# EAGLE board iMX233-OLinuXino-NANO_Rev_B (EAGLE 6.6.0), part 1 of 2
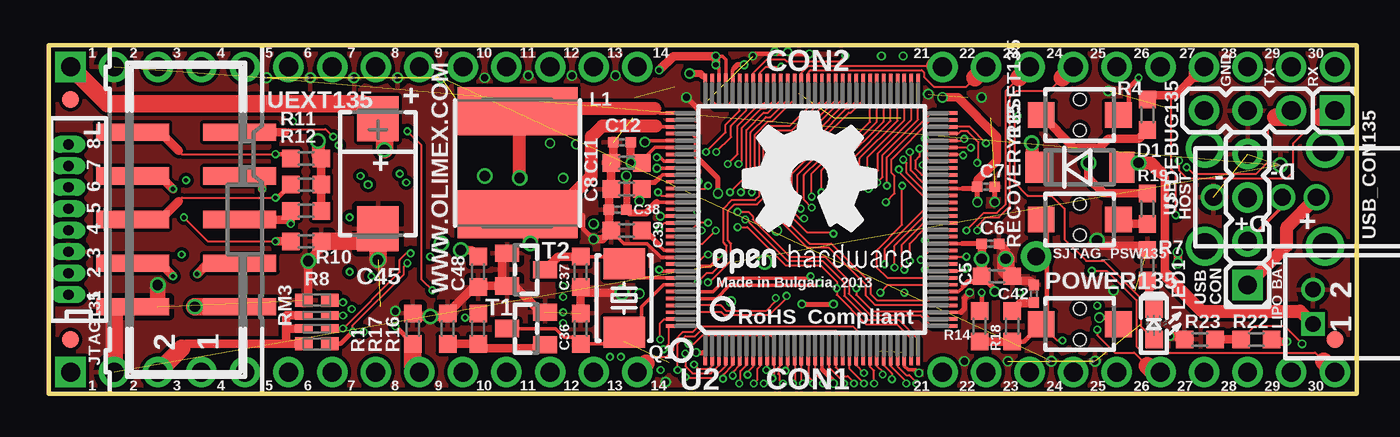
[diagram p1: board, top side]
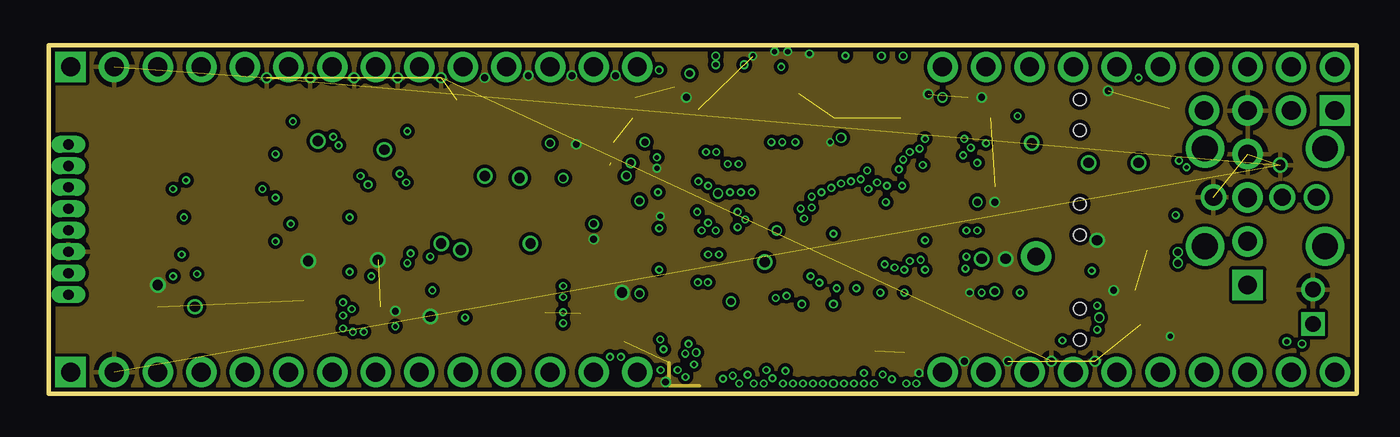
[diagram p2: board, inner layer Route2]
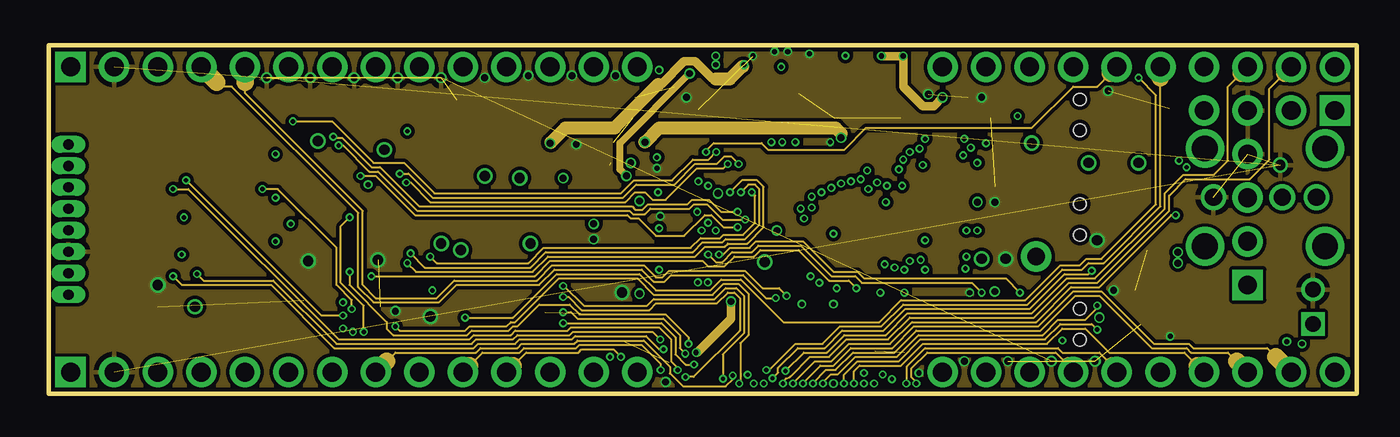
[diagram p3: board, inner layer Route3]
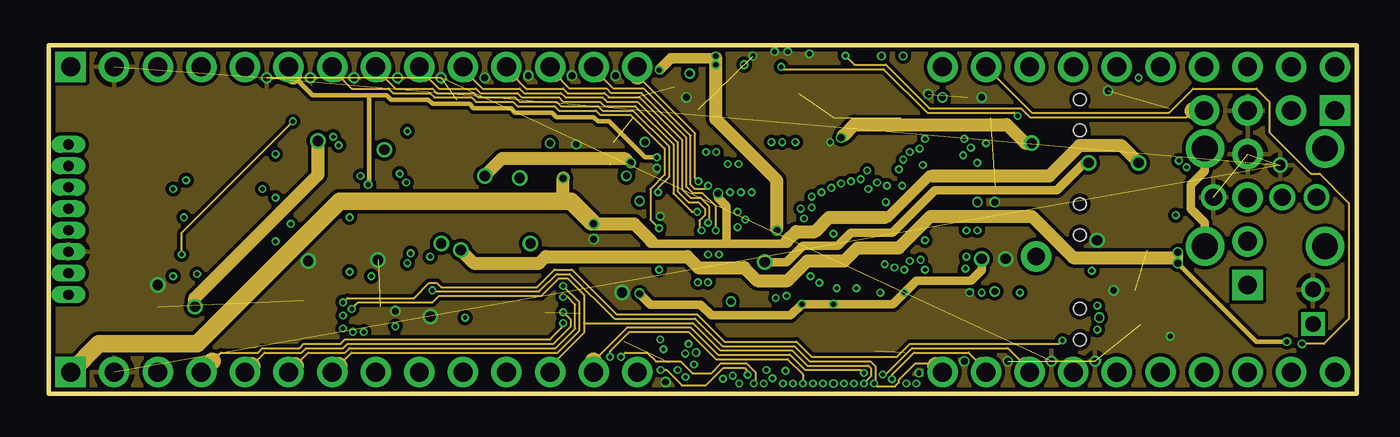
[diagram p4: board, inner layer Route14]
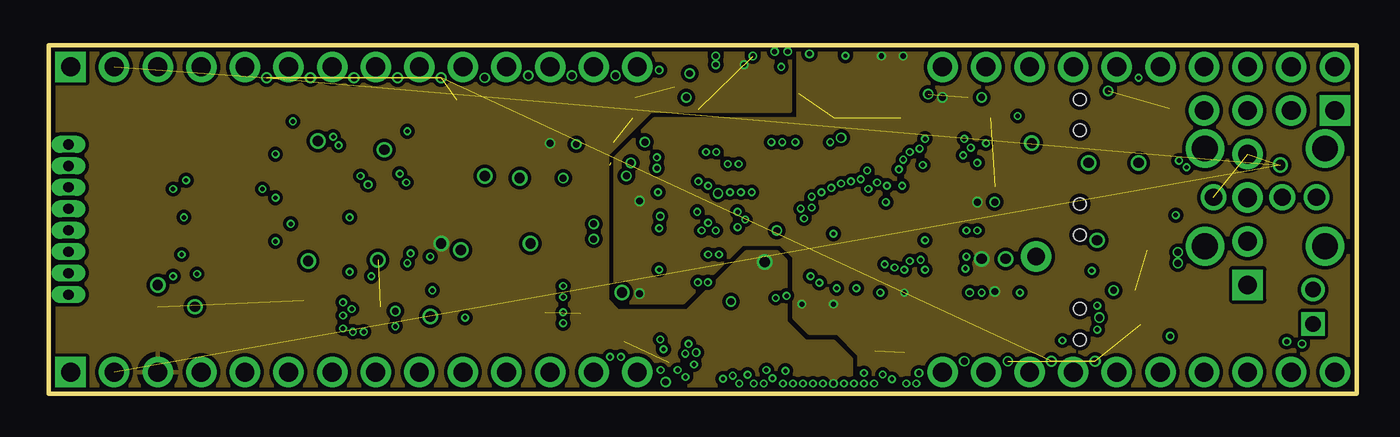
[diagram p5: board, inner layer Route15]
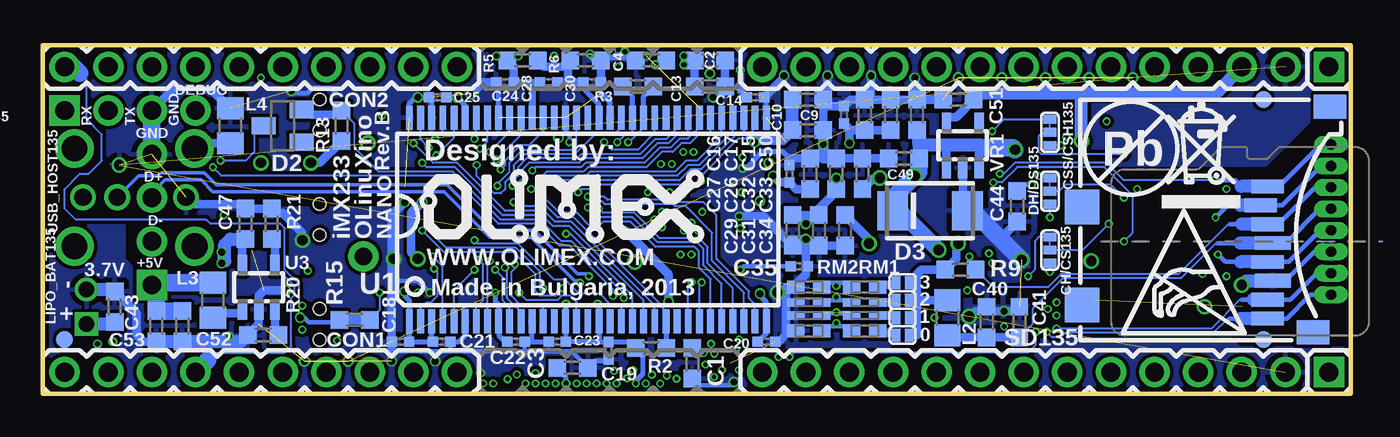
[diagram p6: board, bottom side, seen from below]

Size 76.2 x 20.32 mm. Coordinates in mm from the lower left corner, seen from the top.
Outline: 0,0 76.2,0 76.2,20.32 0,20.32 0,0
Copper layers (1*2+3*14+15*16): Top 0.035mm / dielectric 0.13mm / Route2 0.035mm / dielectric 0.6mm / Route3 0.035mm / dielectric 0.13mm / Route14 0.035mm / dielectric 0.6mm / Route15 0.035mm / dielectric 0.13mm / Bottom 0.035mm
Design rules "default": minimum track width 5mil, minimum drill 10mil, track to track 5mil, track to pad 5mil, pad to pad 5mil, via to via 5mil, smd to smd 1mil, copper to edge 10mil, drill to drill 8mil, minimum pad ring 5mil, minimum via ring 4mil, stop-mask expansion 4mil, vias tented up to drill 25mil, thermal gap 12mil
tRestrict: 2 lines
bRestrict: 49 lines

## Footprints (pad centres in the part's own frame; a part is rotated, then mirrored left to right if it is on the bottom)
SJ_1_SMALLER = smd 0.508 x 0.762: 1 -0.381,0; 2 0.381,0
C0603_DWS = smd 1.016 x 1.016: 1 -0.889,0; 2 0.889,0
C0402_TI = smd 0.61 x 0.584: 1 -0.508,0; 2 0.508,0
CT7343 = smd 2.6 x 2.4: + -3.2,0; - 3.2,0
SJ_2_SMALLER = smd 0.508 x 0.762: 1 -0.762,0; 2 0,0; 3 0.762,0
HN1X30_WITHOUT(15-20) = drill 1.1 pad 1.778 square: 1 -36.83,0 | drill 1.1 pad 1.778: 2 -34.29,0; 3 -31.75,0; 4 -29.21,0; 5 -26.67,0; 6 -24.13,0; 7 -21.59,0; 8 -19.05,0; 9 -16.51,0; 10 -13.97,0; 11 -11.43,0; 12 -8.89,0; 13 -6.35,0; 14 -3.81,0; 21 13.97,0; 22 16.51,0; 23 19.05,0; 24 21.59,0; 25 24.13,0; 26 26.67,0; 27 29.21,0; 28 31.75,0; 29 34.29,0; 30 36.83,0
MLL-41 = smd 1.45 x 1.8: A 2.445,0; K -2.445,0
SOT23C = smd 1 x 1.4: 1 -0.95,-1.1; 2 0.95,-1.1; 3 0,1.1
DO214AA = smd 1.778 x 2.286: A 2.177,0; C -2.177,0
WU08S = drill 0.6 pad 0.991 long: 1 -4.375,0; 2 -3.125,0; 3 -1.875,0; 4 -0.625,0; 5 0.625,0; 6 1.875,0; 7 3.125,0; 8 4.375,0
L7078 = smd 2.8 x 7: 1 -3,0; 2 3,0
L0805_5MIL_DWS = smd 1.27 x 1.524: 1 -1.016,0; 2 1.016,0
LED-0603 = smd 1.016 x 1.016: A 0.889,0; C -0.889,0
DW02R = drill 0.9 square: 1 -1,0 | drill 0.9: 2 1,0
IT1185AU2 = smd 1.55 x 1.5: 1 -2.25,0; 2 2.25,0 | hole 0.7: 0,-0.9; 0,0.9
HCX-4S = smd 1.8 x 2.4: 1 -2,0; 2 2,0
R0603_5MIL_DWS = smd 1.016 x 1.016: 1 -0.889,0; 2 0.889,0
0603_0R = smd 1.016 x 1.016: 1 -0.889,0; 2 0.889,0
R_MATRIX_4 = smd 1.016 x 0.762: 1.1 -0.762,1.27; 1.2 0.762,1.27; 4.1 -0.762,-1.27; 4.2 0.762,-1.27 | smd 1.016 x 0.508: 2.1 -0.762,0.381; 2.2 0.762,0.381; 3.1 -0.762,-0.381; 3.2 0.762,-0.381
TFR/C-MEM-CON = smd 0.8 x 1.9: 1 -3.2,10.9; 2 -2.1,10.5; 3 -1,10.9; 5 1.2,10.9; 7 3.4,10.9; 8 4.5,10.9 | smd 0.8 x 2.1: 4 0.1,11.2; 6 2.3,11.2 | smd 2 x 2: 9 3.7,0.1; 10 -2,0.1 | smd 1.4 x 1.9: 11 5.3,13.55; 12 -7.85,14.55
TESTPAD = drill 1.016 pad 1.778: P$1 0,0
SOT23 = smd 1 x 1.4: 1 -0.95,-1.1; 2 0.95,-1.1; 3 0,1.1
66TSOP-II = smd 0.4 x 1.4: 1 -10.4,-5.925; 2 -9.75,-5.925; 3 -9.1,-5.925; 4 -8.45,-5.925; 5 -7.8,-5.925; 6 -7.15,-5.925; 7 -6.5,-5.925; 8 -5.85,-5.925; 9 -5.2,-5.925; 10 -4.55,-5.925; 11 -3.9,-5.925; 12 -3.25,-5.925; 13 -2.6,-5.925; 14 -1.95,-5.925; 15 -1.3,-5.925; 16 -0.65,-5.925; 17 0,-5.925; 18 0.65,-5.925; 19 1.3,-5.925; 20 1.95,-5.925; 21 2.6,-5.925; 22 3.25,-5.925; 23 3.9,-5.925; 24 4.55,-5.925; 25 5.2,-5.925; 26 5.85,-5.925; 27 6.5,-5.925; 28 7.15,-5.925; 29 7.8,-5.925; 30 8.45,-5.925; 31 9.1,-5.925; 32 9.75,-5.925; 33 10.4,-5.925; 34 10.4,5.925; 35 9.75,5.925; 36 9.1,5.925; 37 8.45,5.925; 38 7.8,5.925; 39 7.15,5.925; 40 6.5,5.925; 41 5.85,5.925; 42 5.2,5.925; 43 4.55,5.925; 44 3.9,5.925; 45 3.25,5.925; 46 2.6,5.925; 47 1.95,5.925; 48 1.3,5.925; 49 0.65,5.925; 50 0,5.925; 51 -0.65,5.925; 52 -1.3,5.925; 53 -1.95,5.925; 54 -2.6,5.925; 55 -3.25,5.925; 56 -3.9,5.925; 57 -4.55,5.925; 58 -5.2,5.925; 59 -5.85,5.925; 60 -6.5,5.925; 61 -7.15,5.925; 62 -7.8,5.925; 63 -8.45,5.925; 64 -9.1,5.925; 65 -9.75,5.925; 66 -10.4,5.925
TQFP128LD = smd 0.2 x 1.5: 1 -6.2,-7.75; 2 -5.8,-7.75; 3 -5.4,-7.75; 4 -5,-7.75; 5 -4.6,-7.75; 6 -4.2,-7.75; 7 -3.8,-7.75; 8 -3.4,-7.75; 9 -3,-7.75; 10 -2.6,-7.75; 11 -2.2,-7.75; 12 -1.8,-7.75; 13 -1.4,-7.75; 14 -1,-7.75; 15 -0.6,-7.75; 16 -0.2,-7.75; 17 0.2,-7.75; 18 0.6,-7.75; 19 1,-7.75; 20 1.4,-7.75; 21 1.8,-7.75; 22 2.2,-7.75; 23 2.6,-7.75; 24 3,-7.75; 25 3.4,-7.75; 26 3.8,-7.75; 27 4.2,-7.75; 28 4.6,-7.75; 29 5,-7.75; 30 5.4,-7.75; 31 5.8,-7.75; 32 6.2,-7.75; 65 6.2,7.75; 66 5.8,7.75; 67 5.4,7.75; 68 5,7.75; 69 4.6,7.75; 70 4.2,7.75; 71 3.8,7.75; 72 3.4,7.75; 73 3,7.75; 74 2.6,7.75; 75 2.2,7.75; 76 1.8,7.75; 77 1.4,7.75; 78 1,7.75; 79 0.6,7.75; 80 0.2,7.75; 81 -0.2,7.75; 82 -0.6,7.75; 83 -1,7.75; 84 -1.4,7.75; 85 -1.8,7.75; 86 -2.2,7.75; 87 -2.6,7.75; 88 -3,7.75; 89 -3.4,7.75; 90 -3.8,7.75; 91 -4.2,7.75; 92 -4.6,7.75; 93 -5,7.75; 94 -5.4,7.75; 95 -5.8,7.75; 96 -6.2,7.75 | smd 1.5 x 0.2: 33 7.75,-6.2; 34 7.75,-5.8; 35 7.75,-5.4; 36 7.75,-5; 37 7.75,-4.6; 38 7.75,-4.2; 39 7.75,-3.8; 40 7.75,-3.4; 41 7.75,-3; 42 7.75,-2.6; 43 7.75,-2.2; 44 7.75,-1.8; 45 7.75,-1.4; 46 7.75,-1; 47 7.75,-0.6; 48 7.75,-0.2; 49 7.75,0.2; 50 7.75,0.6; 51 7.75,1; 52 7.75,1.4; 53 7.75,1.8; 54 7.75,2.2; 55 7.75,2.6; 56 7.75,3; 57 7.75,3.4; 58 7.75,3.8; 59 7.75,4.2; 60 7.75,4.6; 61 7.75,5; 62 7.75,5.4; 63 7.75,5.8; 64 7.75,6.2; 97 -7.75,6.2; 98 -7.75,5.8; 99 -7.75,5.4; 100 -7.75,5; 101 -7.75,4.6; 102 -7.75,4.2; 103 -7.75,3.8; 104 -7.75,3.4; 105 -7.75,3; 106 -7.75,2.6; 107 -7.75,2.2; 108 -7.75,1.8; 109 -7.75,1.4; 110 -7.75,1; 111 -7.75,0.6; 112 -7.75,0.2; 113 -7.75,-0.2; 114 -7.75,-0.6; 115 -7.75,-1; 116 -7.75,-1.4; 117 -7.75,-1.8; 118 -7.75,-2.2; 119 -7.75,-2.6; 120 -7.75,-3; 121 -7.75,-3.4; 122 -7.75,-3.8; 123 -7.75,-4.2; 124 -7.75,-4.6; 125 -7.75,-5; 126 -7.75,-5.4; 127 -7.75,-5.8; 128 -7.75,-6.2
SOT23-5 = smd 0.55 x 1.2: 1 -0.95,-1.3; 2 0,-1.3; 3 0.95,-1.3; 4 0.95,1.3; 5 -0.95,1.3
FIDUCIAL-1X2 = smd 1 x 1: 1 0,0
HN1X4 = drill 1.1 pad 1.778 square: 1 -3.81,0 | drill 1.1 pad 1.778: 2 -1.27,0; 3 1.27,0; 4 3.81,0
ML10_S = smd 1 x 4.25: 1 -5.08,-3.125; 2 -5.08,3.125; 3 -2.54,-3.125; 4 -2.54,3.125; 5 0,-3.125; 6 0,3.125; 7 2.54,-3.125; 8 2.54,3.125; 9 5.08,-3.125; 10 5.08,3.125
USB_A_VERTICAL_PTH = drill 1: 1 3.45,12.75; 2 3.45,14.75; 3 3.45,16.75; 4 3.45,18.75 | drill 1.5: P$1 0.6,12.25; P$2 6.3,12.25; P$3 6.3,19.25; P$4 0.6,19.25
VPAC0 = drill 0.6 pad 0.9: VP 0,0
VPAC1 = drill 0.4 pad 0.603: VP 0,0
SOT-23-5 = smd 0.55 x 1.2: 1 -0.95,-1.3; 2 0,-1.3; 3 0.95,-1.3; 4 0.95,1.3; 5 -0.95,1.3

## Placement (x,y rotation side)
0  Close  [SJ_1_SMALLER]  26.11,3.43 0 bottom
1  Open  [SJ_1_SMALLER]  26.11,4.45 0 bottom
2  Open  [SJ_1_SMALLER]  26.11,5.46 0 bottom
3  Close  [SJ_1_SMALLER]  26.11,6.48 0 bottom
C1  22uF/6.3V  [C0603_DWS]  38.35,1.78 90 bottom
C2  22uF/6.3V  [C0603_DWS]  37.34,19.43 180 bottom
C3  22uF/6.3V  [C0603_DWS]  45.34,1.52 180 bottom
C4  22uF/6.3V  [C0603_DWS]  40.77,19.43 0 bottom
C5  22uF/6.3V  [C0603_DWS]  55.24,6.86 180 top
C6  100nF  [C0402_TI]  54.86,8.76 180 top
C7  100nF  [C0402_TI]  54.61,12.06 180 top
C8  22uF/6.3V  [C0603_DWS]  33.66,11.94 0 top
C9  22uF/6.3V  [C0603_DWS]  31.62,17.14 180 bottom
C10  22uF/6.3V  [C0603_DWS]  31.62,15.37 180 bottom
C11  22uF/6.3V  [C0603_DWS]  33.66,13.46 0 top
C12  100nF  [C0402_TI]  33.4,14.67 0 top
C13  22uF/6.3V  [C0603_DWS]  37.34,17.91 180 bottom
C14  100nF  [C0402_TI]  34.67,17.27 180 bottom
C15  22uF/6.3V  [C0603_DWS]  26.8,16.26 270 bottom
C16  100nF  [C0402_TI]  29.53,16.26 270 bottom
C17  22uF/6.3V  [C0603_DWS]  28.32,16.26 270 bottom
C18  100nF  [C0402_TI]  55.37,3.05 0 bottom
C19  100nF  [C0402_TI]  43.24,2.53 90 bottom
C20  100nF  [C0402_TI]  34.04,3.05 180 bottom
C21  100nF  [C0402_TI]  52.96,3.05 180 bottom
C22  100nF  [C0402_TI]  48.64,3.05 180 bottom
C23  100nF  [C0402_TI]  46.23,3.05 0 bottom
C24  100nF  [C0402_TI]  49.28,18.16 0 bottom
C25  100nF  [C0402_TI]  53.21,17.27 0 bottom
C26  22uF/6.3V  [C0603_DWS]  31.5,12.83 270 bottom
C27  100nF  [C0402_TI]  32.7,12.83 270 bottom
C28  100nF  [C0402_TI]  46.74,18.16 0 bottom
C29  22uF/6.3V  [C0603_DWS]  32.51,9.53 90 bottom
C30  100nF  [C0402_TI]  44.2,18.16 180 bottom
C31  22uF/6.3V  [C0603_DWS]  30.99,9.53 90 bottom
C32  22uF/6.3V  [C0603_DWS]  29.97,12.83 270 bottom
C33  NA(10pF)  [C0603_DWS]  28.45,12.83 270 bottom
C34  100pF  [C0603_DWS]  29.46,9.53 90 bottom
C35  100nF  [C0402_TI]  32.13,7.43 180 bottom
C36  10pF  [C0603_DWS]  30.99,3.81 270 top
C37  10pF  [C0603_DWS]  30.99,7.11 90 top
C38  100nF  [C0402_TI]  33.15,10.73 0 top
C39  1uF  [C0603_DWS]  33.66,9.53 0 top
C40  22uF/6.3V  [C0603_DWS]  21.21,4.19 270 bottom
C41  22uF/6.3V  [C0603_DWS]  19.3,4.19 270 bottom
C42  100nF  [C0402_TI]  57.4,5.84 90 top
C43  22uF/6.3V  [C0603_DWS]  72.01,5.08 90 bottom
C44  47pF  [C0603_DWS]  19.43,10.92 270 bottom
C45  220uF/10V/TANT  [CT7343]  19.18,12.83 270 top
C47  100nF  [C0603_DWS]  64.39,9.91 90 bottom
C48  22uF/6.3V  [C0603_DWS]  25.02,7.11 270 top
C49  22uF/6.3V  [C0603_DWS]  26.04,13.72 180 bottom
C50  22uF/6.3V  [C0603_DWS]  25.27,16.26 90 bottom
C51  22uF/6.3V  [C0603_DWS]  22.86,17.14 180 bottom
C52  22uF/6.3V  [C0603_DWS]  68.07,3.94 270 bottom
C53  22uF/6.3V  [C0603_DWS]  69.6,3.94 270 bottom
CH/CS135  SCL_HW:Open/SCL_SW:Close  [SJ_2_SMALLER]  17.53,8.38 90 bottom
CON1  HN1X30_WITHOUT(15-20)  [HN1X30_WITHOUT(15-20)]  38.1,1.27 180 bottom
CON2  HN1X30_WITHOUT(15-20)  [HN1X30_WITHOUT(15-20)]  38.1,19.05 180 bottom
CSS/CSH135  CS_SW:Open/CS_HW:Close  [SJ_2_SMALLER]  17.53,15.24 90 bottom
D1  1N5819/SS14  [MLL-41]  60.07,13.21 0 top
D2  BAT54C  [SOT23C]  62.23,15.62 90 bottom
D3  SMBJ6.0A  [DO214AA]  24.51,10.67 0 bottom
DH/DS135  SDA_HW:Open/SDA_SW:Close  [SJ_2_SMALLER]  17.53,11.81 90 bottom
JTAG135  NA(WU08S)  [WU08S]  1.14,10.16 90 top
L1  22uH/1.5A/YS75/7x8mm  [L7078]  27.3,13.46 90 top
L2  CL470nH/0805/1.76R/250mA  [L0805_5MIL_DWS]  23.5,4.45 270 bottom
L3  FB0805/600R/2A  [L0805_5MIL_DWS]  66.29,5.46 270 bottom
L4  FB0805/600R/200mA(201209-601)  [L0805_5MIL_DWS]  65.28,15.62 270 bottom
LED1  GREEN(0603)  [LED-0603]  64.39,4.06 270 top
LIPO_BAT135  CON2DW02R  [DW02R]  73.66,5.08 90 top
POWER135  SW-TAKTIT1185AU2  [IT1185AU2]  60.07,4.06 180 top
Q1  4SB24.000F20E15/5x3.2mm/20ppm/20pF  [HCX-4S]  33.53,5.59 270 top
R1  NA(47k)  [R0603_5MIL_DWS]  21.21,3.81 270 top
R2  10k  [R0603_5MIL_DWS]  40.77,2.67 180 bottom
R3  NA(120R)  [R0603_5MIL_DWS]  41.53,17.91 0 bottom
R4  47k  [R0603_5MIL_DWS]  64.01,16.26 90 top
R5  1k/1%  [R0603_5MIL_DWS]  48.26,19.43 180 bottom
R6  1k/1%  [R0603_5MIL_DWS]  44.58,19.43 180 bottom
R7  2.2k  [R0603_5MIL_DWS]  64.01,7.49 270 top
R8  1M  [R0603_5MIL_DWS]  14.99,8.89 0 top
R9  10k  [R0603_5MIL_DWS]  22.73,7.24 180 bottom
R10  2.2k  [R0603_5MIL_DWS]  14.99,10.67 0 top
R11  47k  [R0603_5MIL_DWS]  14.99,13.72 0 top
R12  2.2k  [R0603_5MIL_DWS]  14.99,12.19 0 top
R13  4.7k  [R0603_5MIL_DWS]  58.8,15.62 90 bottom
R14  1k/1%  [R0603_5MIL_DWS]  54.23,3.94 270 top
R15  0R(Board_Mounted)  [0603_0R]  58.04,4.32 0 bottom
R16  2.2k  [R0603_5MIL_DWS]  25.02,3.81 90 top
R17  2.2k  [R0603_5MIL_DWS]  23.24,3.81 90 top
R18  1k/1%  [R0603_5MIL_DWS]  56.13,3.94 270 top
R19  10k  [R0603_5MIL_DWS]  64.01,10.79 90 top
R20  10k  [R0603_5MIL_DWS]  63.37,3.43 0 bottom
R21  10k  [R0603_5MIL_DWS]  62.87,9.91 270 bottom
R22  NA(22k)  [R0603_5MIL_DWS]  70.36,3.17 0 top
R23  NA(33k)  [R0603_5MIL_DWS]  67.06,3.17 0 top
RECOVERY135  SW-TAKTIT1185AU2  [IT1185AU2]  60.07,10.16 180 top
RESET135  SW-TAKTIT1185AU2  [IT1185AU2]  60.07,16.26 180 top
RM1  RA1206_(4X0603)_4B8_4.7K  [R_MATRIX_4]  28.32,4.95 180 bottom
RM2  RA1206_(4X0603)_4B8_47K  [R_MATRIX_4]  31.57,4.95 180 bottom
RM3  RA1206_(4X0603)_4B8_100K  [R_MATRIX_4]  15.62,4.19 0 top
SD135  MICRO_SD/MMC_NEW  [TFR/C-MEM-CON]  15.75,8.89 270 bottom
SJTAG_PSW135  TESTPAD40/70  [TESTPAD]  57.53,8 0 top
T1  BC846B  [SOT23]  27.81,3.81 90 top
T2  BC846B  [SOT23]  27.81,7.24 270 top
U1  HY5DU121622D(L)T(P)-J  [66TSOP-II]  44.45,10.16 0 bottom
U2  MCIMX233CAG4C  [TQFP128LD]  44.45,10.16 0 top
U3  SY6280  [SOT23-5]  63.63,6.22 0 bottom
U$1  FIDUCIAL1X2  [FIDUCIAL-1X2]  1.27,17.14 180 top
U$2  FIDUCIAL1X2  [FIDUCIAL-1X2]  74.93,3.17 180 top
U$3  FIDUCIAL1X2  [FIDUCIAL-1X2]  1.27,3.17 180 top
U$4  [ESD_SYMBOL]  13.28,3.55 0 bottom
U$6  [RECYCLE_BIN1/8]  10.99,10.82 0 bottom
U$7  FIDUCIAL1X2  [FIDUCIAL-1X2]  5.08,17.14 0 bottom
U$8  [OLIMEX1_V]  36.52,8.65 0 bottom
U$13  FIDUCIAL1X2  [FIDUCIAL-1X2]  5.08,3.17 0 bottom
U$14  FIDUCIAL1X2  [FIDUCIAL-1X2]  74.93,3.17 0 bottom
U$15  [PB]  12.81,14.3 0 bottom
U$18  [LOGO-OPENHARDWARE_8X8]  44.32,12.45 0 top
U_DEBUG135  HN1X4  [HN1X4]  71.12,16.51 180 top
UEXT135  GBH-SMT-10  [ML10_S]  8,10.16 90 top
USB_CON135  HN1X4  [HN1X4]  69.85,10.16 90 top
USB_HOST135  USB_SHIELDUSB_A_VERTICAL  [USB_A_VERTICAL_PTH]  86.61,8 90 top
VP_0  VPDEV0  [VPAC0]  71.75,13.34 0 top
VP_1  VPDEV1  [VPAC1]  12.7,18.41 0 top
VP_2  VPDEV1  [VPAC1]  15.24,18.41 0 top
VP_3  VPDEV1  [VPAC1]  17.78,18.41 0 top
VP_4  VPDEV1  [VPAC1]  20.32,18.41 0 top
VP_5  VPDEV1  [VPAC1]  22.86,18.41 0 top
VP_6  VPDEV1  [VPAC1]  58.42,1.91 0 top
VP_7  VPDEV1  [VPAC1]  60.96,1.91 0 top
VR1  AP1231-33  [SOT-23-5]  22.61,14.48 0 bottom